# Altium schematic sheet Optocoupler_Interface.SchDoc
size A3; DocumentNumber: 5; SheetNumber: 5; SheetTotal: 11
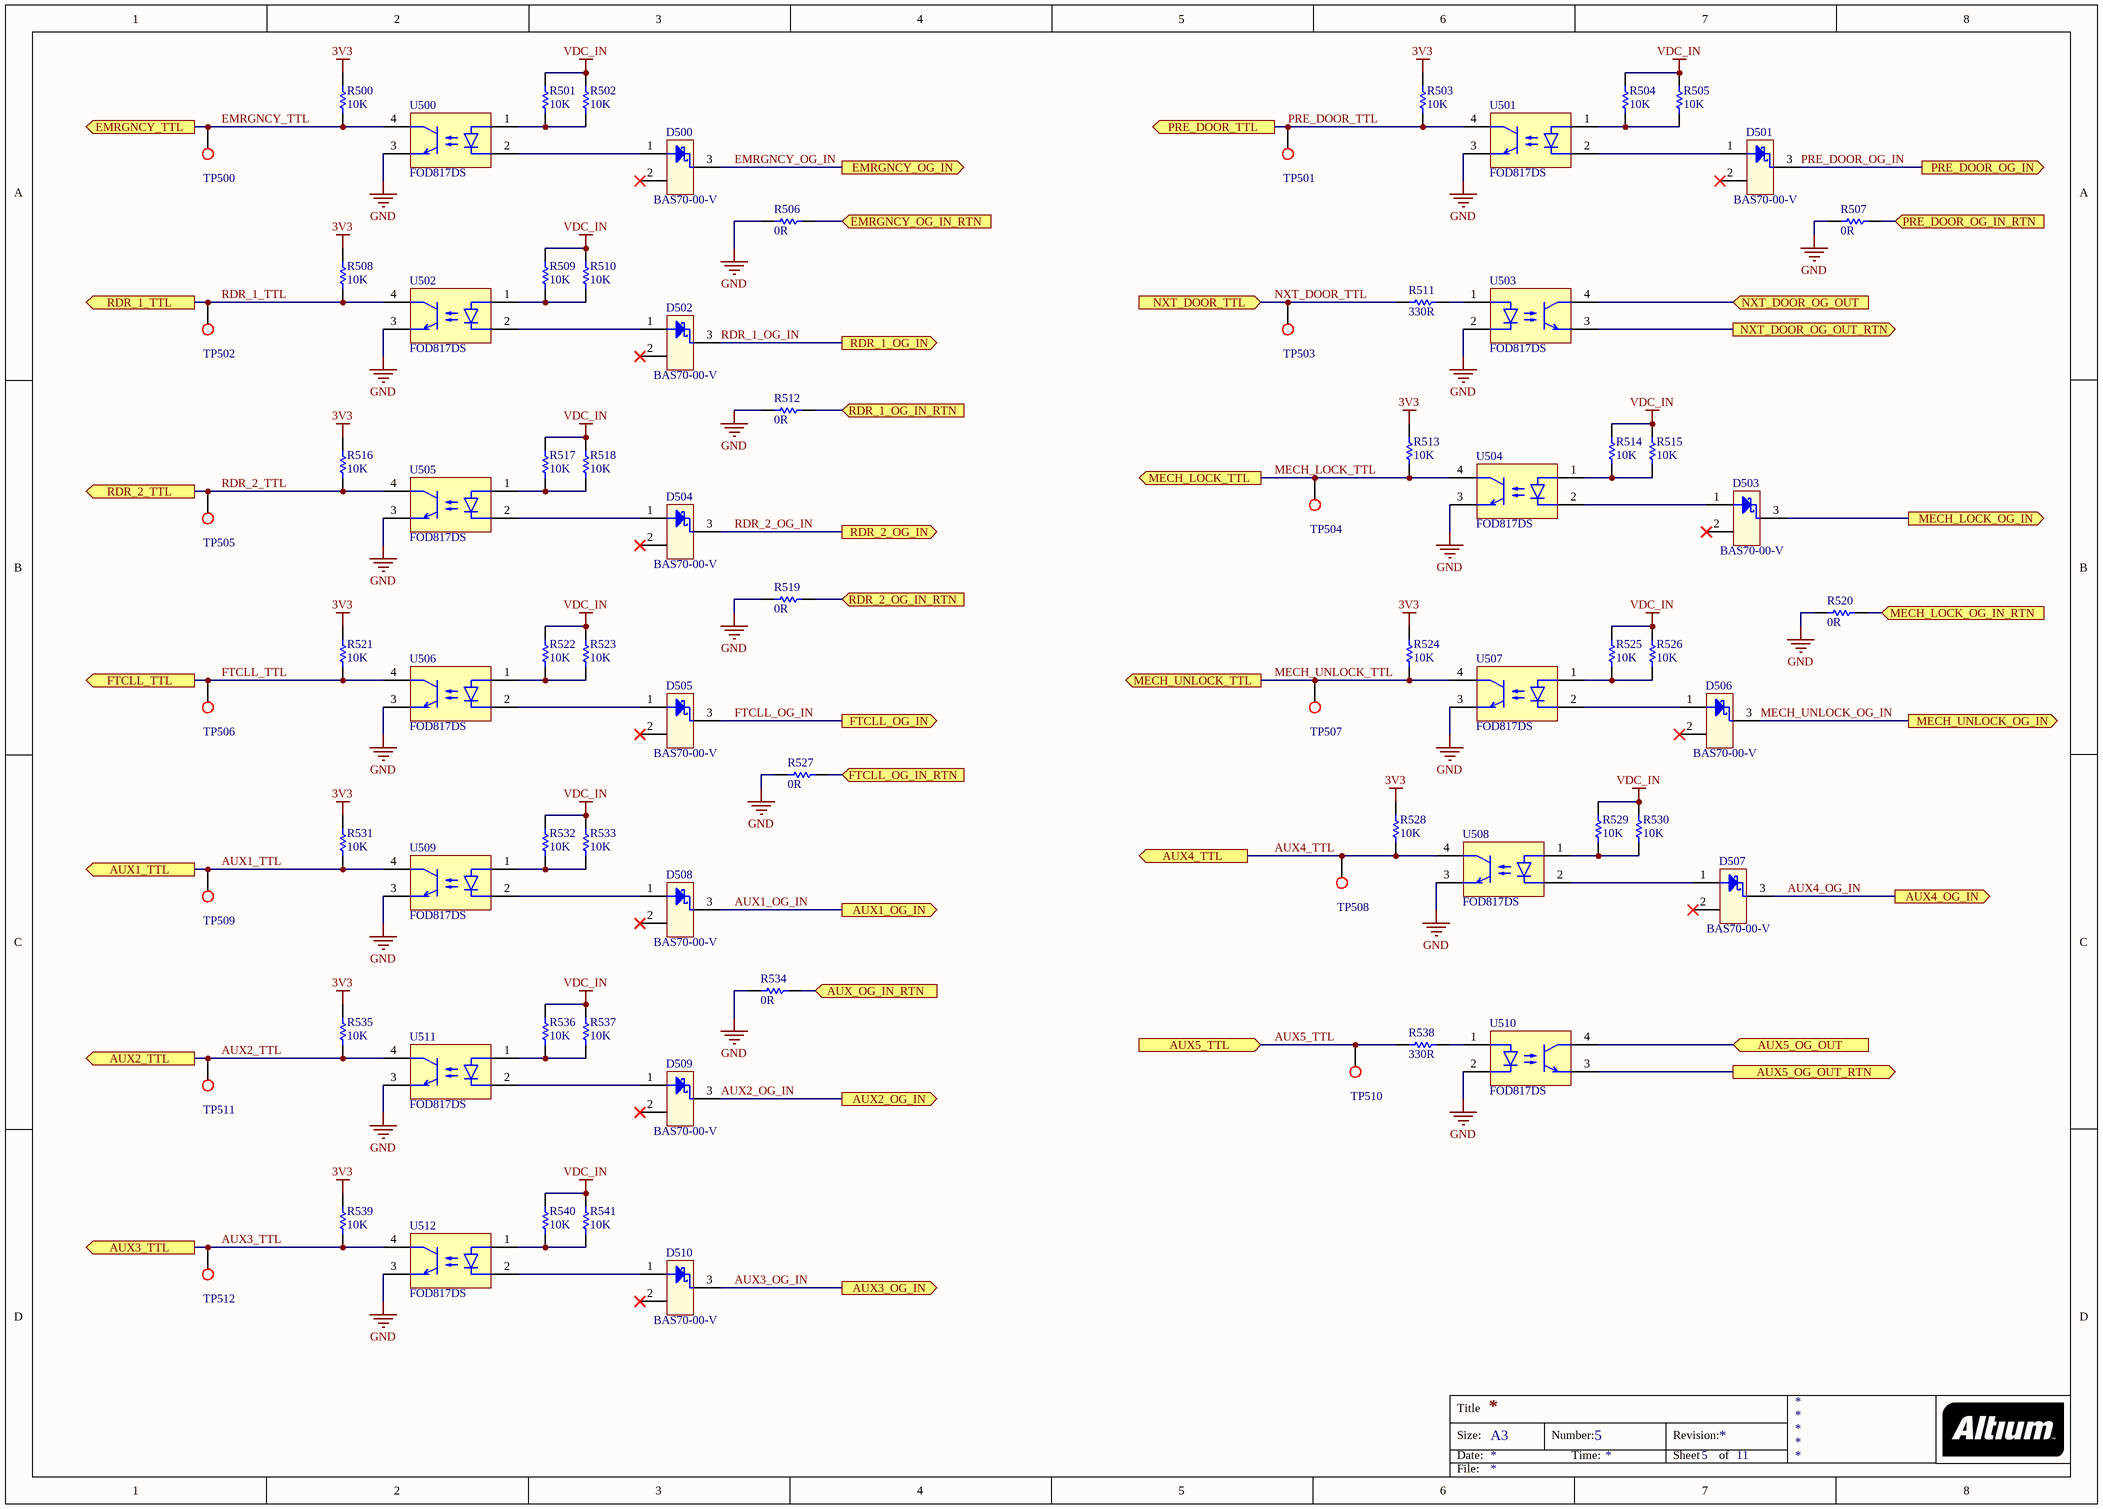
[diagram p0: Optocoupler_Interface.SchDoc]

## Parts
D500  BAS70-00-V  [SOT90P247X115-3N]
D501  BAS70-00-V  [SOT90P247X115-3N]
D502  BAS70-00-V  [SOT90P247X115-3N]
D503  BAS70-00-V  [SOT90P247X115-3N]
D504  BAS70-00-V  [SOT90P247X115-3N]
D505  BAS70-00-V  [SOT90P247X115-3N]
D506  BAS70-00-V  [SOT90P247X115-3N]
D507  BAS70-00-V  [SOT90P247X115-3N]
D508  BAS70-00-V  [SOT90P247X115-3N]
D509  BAS70-00-V  [SOT90P247X115-3N]
D510  BAS70-00-V  [SOT90P247X115-3N]
R500  10K  [RESC1005X04N]
R501  10K  [RESC2012X07N]
R502  10K  [RESC2012X07N]
R503  10K  [RESC1005X04N]
R504  10K  [RESC2012X07N]
R505  10K  [RESC2012X07N]
R506  0R  [RESC2012X07N]
R507  0R  [RESC2012X07N]
R508  10K  [RESC1005X04N]
R509  10K  [RESC2012X07N]
R510  10K  [RESC2012X07N]
R511  330R  [RESC1005X04N]
R512  0R  [RESC2012X07N]
R513  10K  [RESC1005X04N]
R514  10K  [RESC2012X07N]
R515  10K  [RESC2012X07N]
R516  10K  [RESC1005X04N]
R517  10K  [RESC2012X07N]
R518  10K  [RESC2012X07N]
R519  0R  [RESC2012X07N]
R520  0R  [RESC2012X07N]
R521  10K  [RESC1005X04N]
R522  10K  [RESC2012X07N]
R523  10K  [RESC2012X07N]
R524  10K  [RESC1005X04N]
R525  10K  [RESC2012X07N]
R526  10K  [RESC2012X07N]
R527  0R  [RESC2012X07N]
R528  10K  [RESC1005X04N]
R529  10K  [RESC2012X07N]
R530  10K  [RESC2012X07N]
R531  10K  [RESC1005X04N]
R532  10K  [RESC2012X07N]
R533  10K  [RESC2012X07N]
R534  0R  [RESC2012X07N]
R535  10K  [RESC1005X04N]
R536  10K  [RESC2012X07N]
R537  10K  [RESC2012X07N]
R538  330R  [RESC1005X04N]
R539  10K  [RESC1005X04N]
R540  10K  [RESC2012X07N]
R541  10K  [RESC2012X07N]
TP500  AEMT-C00S-1000-0000  [TP100]  (value not drawn)
TP501  AEMT-C00S-1000-0000  [TP100]  (value not drawn)
TP502  AEMT-C00S-1000-0000  [TP100]  (value not drawn)
TP503  AEMT-C00S-1000-0000  [TP100]  (value not drawn)
TP504  AEMT-C00S-1000-0000  [TP100]  (value not drawn)
TP505  AEMT-C00S-1000-0000  [TP100]  (value not drawn)
TP506  AEMT-C00S-1000-0000  [TP100]  (value not drawn)
TP507  AEMT-C00S-1000-0000  [TP100]  (value not drawn)
TP508  AEMT-C00S-1000-0000  [TP100]  (value not drawn)
TP509  AEMT-C00S-1000-0000  [TP100]  (value not drawn)
TP510  AEMT-C00S-1000-0000  [TP100]  (value not drawn)
TP511  AEMT-C00S-1000-0000  [TP100]  (value not drawn)
TP512  AEMT-C00S-1000-0000  [TP100]  (value not drawn)
U500  FOD817DS  [SOP254P1020X400-4N]
U501  FOD817DS  [SOP254P1020X400-4N]
U502  FOD817DS  [SOP254P1020X400-4N]
U503  FOD817DS  [SOP254P1020X400-4N]
U504  FOD817DS  [SOP254P1020X400-4N]
U505  FOD817DS  [SOP254P1020X400-4N]
U506  FOD817DS  [SOP254P1020X400-4N]
U507  FOD817DS  [SOP254P1020X400-4N]
U508  FOD817DS  [SOP254P1020X400-4N]
U509  FOD817DS  [SOP254P1020X400-4N]
U510  FOD817DS  [SOP254P1020X400-4N]
U511  FOD817DS  [SOP254P1020X400-4N]
U512  FOD817DS  [SOP254P1020X400-4N]

## Ports
AUX1_OG_IN (out), AUX1_TTL (out), AUX2_OG_IN (out), AUX2_TTL (out), AUX3_OG_IN (out), AUX3_TTL (out), AUX4_OG_IN (out), AUX4_TTL (out), AUX5_OG_OUT (in), AUX5_OG_OUT_RTN (out), AUX5_TTL (in), AUX_OG_IN_RTN (in), EMRGNCY_OG_IN (out), EMRGNCY_OG_IN_RTN (in), EMRGNCY_TTL (out), FTCLL_OG_IN (out), FTCLL_OG_IN_RTN (in), FTCLL_TTL (out), MECH_LOCK_OG_IN (out), MECH_LOCK_OG_IN_RTN (in), MECH_LOCK_TTL (out), MECH_UNLOCK_OG_IN (out), MECH_UNLOCK_TTL (out), NXT_DOOR_OG_OUT (in), NXT_DOOR_OG_OUT_RTN (out), NXT_DOOR_TTL (in), PRE_DOOR_OG_IN (out), PRE_DOOR_OG_IN_RTN (in), PRE_DOOR_TTL (out), RDR_1_OG_IN (out), RDR_1_OG_IN_RTN (in), RDR_1_TTL (out), RDR_2_OG_IN (out), RDR_2_OG_IN_RTN (in), RDR_2_TTL (out)

## Nets
3V3: R500.2 R503.2 R508.2 R513.2 R516.2 R521.2 R524.2 R528.2 R531.2 R535.2 R539.2
GND: R506.1 R507.2 R512.1 R519.1 R520.2 R527.1 R534.2 U500.3(E1) U501.3(E1) U502.3(E1) U503.2(K1) U504.3(E1) U505.3(E1) U506.3(E1) U507.3(E1) U508.3(E1) U509.3(E1) U510.2(K1) U511.3(E1) U512.3(E1)
VDC_IN: R501.1 R502.1 R504.1 R505.1 R509.1 R510.1 R514.1 R515.1 R517.1 R518.1 R522.1 R523.1 R525.1 R526.1 R529.1 R530.1 R532.1 R533.1 R536.1 R537.1 R540.1 R541.1
AUX1_OG_IN: D508.3 ; port AUX1_OG_IN
AUX1_TTL: R531.1 TP509.1 U509.4(C1) ; port AUX1_TTL
AUX2_OG_IN: D509.3 ; port AUX2_OG_IN
AUX2_TTL: R535.1 TP511.1 U511.4(C1) ; port AUX2_TTL
AUX3_OG_IN: D510.3 ; port AUX3_OG_IN
AUX3_TTL: R539.1 TP512.1 U512.4(C1) ; port AUX3_TTL
AUX4_OG_IN: D507.3 ; port AUX4_OG_IN
AUX4_TTL: R528.1 TP508.1 U508.4(C1) ; port AUX4_TTL
AUX5_OG_OUT: U510.4(C1) ; port AUX5_OG_OUT
AUX5_OG_OUT_RTN: U510.3(E1) ; port AUX5_OG_OUT_RTN
AUX5_TTL: R538.1 TP510.1 ; port AUX5_TTL
AUX_OG_IN_RTN: R534.1 ; port AUX_OG_IN_RTN
EMRGNCY_OG_IN: D500.3 ; port EMRGNCY_OG_IN
EMRGNCY_OG_IN_RTN: R506.2 ; port EMRGNCY_OG_IN_RTN
EMRGNCY_TTL: R500.1 TP500.1 U500.4(C1) ; port EMRGNCY_TTL
FTCLL_OG_IN: D505.3 ; port FTCLL_OG_IN
FTCLL_OG_IN_RTN: R527.2 ; port FTCLL_OG_IN_RTN
FTCLL_TTL: R521.1 TP506.1 U506.4(C1) ; port FTCLL_TTL
MECH_LOCK_OG_IN: D503.3 ; port MECH_LOCK_OG_IN
MECH_LOCK_OG_IN_RTN: R520.1 ; port MECH_LOCK_OG_IN_RTN
MECH_LOCK_TTL: R513.1 TP504.1 U504.4(C1) ; port MECH_LOCK_TTL
MECH_UNLOCK_OG_IN: D506.3 ; port MECH_UNLOCK_OG_IN
MECH_UNLOCK_TTL: R524.1 TP507.1 U507.4(C1) ; port MECH_UNLOCK_TTL
NXT_DOOR_OG_OUT: U503.4(C1) ; port NXT_DOOR_OG_OUT
NXT_DOOR_OG_OUT_RTN: U503.3(E1) ; port NXT_DOOR_OG_OUT_RTN
NXT_DOOR_TTL: R511.1 TP503.1 ; port NXT_DOOR_TTL
PRE_DOOR_OG_IN: D501.3 ; port PRE_DOOR_OG_IN
PRE_DOOR_OG_IN_RTN: R507.1 ; port PRE_DOOR_OG_IN_RTN
PRE_DOOR_TTL: R503.1 TP501.1 U501.4(C1) ; port PRE_DOOR_TTL
RDR_1_OG_IN: D502.3 ; port RDR_1_OG_IN
RDR_1_OG_IN_RTN: R512.2 ; port RDR_1_OG_IN_RTN
RDR_1_TTL: R508.1 TP502.1 U502.4(C1) ; port RDR_1_TTL
RDR_2_OG_IN: D504.3 ; port RDR_2_OG_IN
RDR_2_OG_IN_RTN: R519.2 ; port RDR_2_OG_IN_RTN
RDR_2_TTL: R516.1 TP505.1 U505.4(C1) ; port RDR_2_TTL
NetD500_1: D500.1 U500.2(K1)
NetD501_1: D501.1 U501.2(K1)
NetD502_1: D502.1 U502.2(K1)
NetD503_1: D503.1 U504.2(K1)
NetD504_1: D504.1 U505.2(K1)
NetD505_1: D505.1 U506.2(K1)
NetD506_1: D506.1 U507.2(K1)
NetD507_1: D507.1 U508.2(K1)
NetD508_1: D508.1 U509.2(K1)
NetD509_1: D509.1 U511.2(K1)
NetD510_1: D510.1 U512.2(K1)
NetR501_2: R501.2 R502.2 U500.1(A1)
NetR504_2: R504.2 R505.2 U501.1(A1)
NetR509_2: R509.2 R510.2 U502.1(A1)
NetR511_2: R511.2 U503.1(A1)
NetR514_2: R514.2 R515.2 U504.1(A1)
NetR517_2: R517.2 R518.2 U505.1(A1)
NetR522_2: R522.2 R523.2 U506.1(A1)
NetR525_2: R525.2 R526.2 U507.1(A1)
NetR529_2: R529.2 R530.2 U508.1(A1)
NetR532_2: R532.2 R533.2 U509.1(A1)
NetR536_2: R536.2 R537.2 U511.1(A1)
NetR538_2: R538.2 U510.1(A1)
NetR540_2: R540.2 R541.2 U512.1(A1)

Not connected (* = marked no-connect by the designer): D500 2(NC)*; D501 2(NC)*; D502 2(NC)*; D503 2(NC)*; D504 2(NC)*; D505 2(NC)*; D506 2(NC)*; D507 2(NC)*; D508 2(NC)*; D509 2(NC)*; D510 2(NC)*

## Notes on the sheet
- Title
- Size:
- Date:
- A3
- Number:
- Time:
- Revision:
- Sheet
- of
- File:

## Library data of the parts
D500-D510 = AS15-820M-SI20-0002: Diode, Schottky, 0.41V @1mA, BAS70-00-V, SOT23; Manufacturer: VISHAY; CR: 000193/78; DS: 000193; Lead Finish: Pb Free; Published by: MU; Requested by: OO; Reverse Voltage: 70V; Price: *; Manufacturer Part Number: BAS70-00-V; Definition Date: 07.02.2013; Footprint Type: SMD; JEDEC Code: *; Operating Temp: -65 to 125 C; Package Reference: SOT23; Revision Date: 16.02.2013; Status: Active; Storage Temp: -65 to 150 C; Supplier: *; Supplier Part Number: *; Component Type: DIODE; Forward Voltage: 0.41V @1mA; Value: BAS70-00-V
R500 R503 R508 R513 R516 R521 R524 R528 R531 R535 R539 = AR19-4100-S2B2-0000: RES, E24, Thick Film, SMD, 10K, 1%, 0.1W, 0402; Manufacturer: Panasonic; Manufacturer Part Number: ERJ-2RKF1002X; CR: DS00073; Requested by: MU; Lead Finish: Pb Free; Max. Operating Voltage: 50V; Definition Date: 16.08.2012; Revision Date: *; Price: *; Supplier: *; Supplier Part Number: *; DS: DS00073; Operating Temp: -55 to 155 C; Storage Temp: -55 to 155 C; Status: Active; Package Reference: EIA 0402, Metric 1005; Component Type: Resistor; Footprint Type: SMD; Published by: MU; JEDEC Code: *; Material: Thick Film; ESR: *; FR: *; Power Rating: 0.1W; Value: 10K
R501 R502 R504 R505 R509 R510 R514 R515 R517 R518 R522 R523 R525 R526 R529 R530 R532 R533 R536 R537 R540 R541 = AR19-4100-S4B2-0000: RES, E24, Thick Film, SMD, 10K, 1%, 0.125W, 0805; Manufacturer: Panasonic; Manufacturer Part Number: ERJ-6ENF1002V; CR: 000073; Requested by: OO; Lead Finish: Pb Free; Published by: MU; Max. Operating Voltage: 150V; Definition Date: 16.02.2013; Revision Date: *; Price: *; Supplier: *; Supplier Part Number: *; DS: 000073; Operating Temp: -55 to 155 C; Storage Temp: -55 to 155 C; Status: Active; Package Reference: EIA 0805, Metric 2012; Component Type: Resistor; Footprint Type: SMD; JEDEC Code: *; Material: Thick Film; ESR: *; FR: *; Power Rating: 0.125W; Value: 10K
R506 R507 R512 R519 R520 R527 R534 = AR19-0000-S407-0000: RES, Thick Film, SMD, 0R, Jumper, 0.125W, 0805; Manufacturer: Panasonic; Manufacturer Part Number: ERJ-6GEY0R00V; CR: 000062; Requested by: MAY; Lead Finish: Pb Free; Published by: MU; Max. Operating Voltage: 150V; Definition Date: 09.11.2012; Revision Date: *; Price: *; Supplier: *; Supplier Part Number: *; DS: 000062; Operating Temp: -55 to 155 C; Storage Temp: -55 to 155 C; Status: Active; Package Reference: EIA 0805, Metric 2012; Component Type: Resistor; Footprint Type: SMD; JEDEC Code: *; Material: Thick Film; ESR: *; FR: *; Power Rating: 0.125W; Value: 0R
R511 R538 = AR19-2330-S2B2-0000: RES, E24, Thick Film, SMD, 330R, 1%, 0.1W, 0402; Manufacturer: Panasonic; Manufacturer Part Number: ERJ-2RKF3300X; CR: DS00073; Requested by: MU; Lead Finish: Pb Free; Max. Operating Voltage: 50V; Definition Date: 16.08.2012; Revision Date: *; Price: *; Supplier: *; Supplier Part Number: *; DS: DS00073; Operating Temp: -55 to 155 C; Storage Temp: -55 to 155 C; Status: Active; Package Reference: EIA 0402, Metric 1005; Component Type: Resistor; Footprint Type: SMD; Published by: MU; JEDEC Code: *; Material: Thick Film; ESR: *; FR: *; Power Rating: 0.1W; Value: 330R
TP500-TP512 = AEMT-C00S-1000-0000: Test Point, Circular, 1mm; Text: TEST_POINT
U500-U512 = ASB1-850M-SM61-0000: Optocoupler, Phototransistor Output, Single Channel, CTR 300-600%, 5000V Isolation; Manufacturer: Fairchild; Lead Finish: Pb Free; Published by: NK; Price: -; Component Type: Optocoupler; Definition Date: 19.07.2015; Footprint Type: SMD; Manufacturer Part Number: FOD817DS; Operating Temp: -55 to 110 C; Package Reference: SOP-4; Requested by: NK; Revision Date: -; Status: Active; Storage Temp: -55 to 150 C; Supplier: *; Supplier Part Number: *; FR: *; Revision By: -; Value: FOD817DS